# EAGLE schematic HoloCubic (EAGLE 9.6.2)
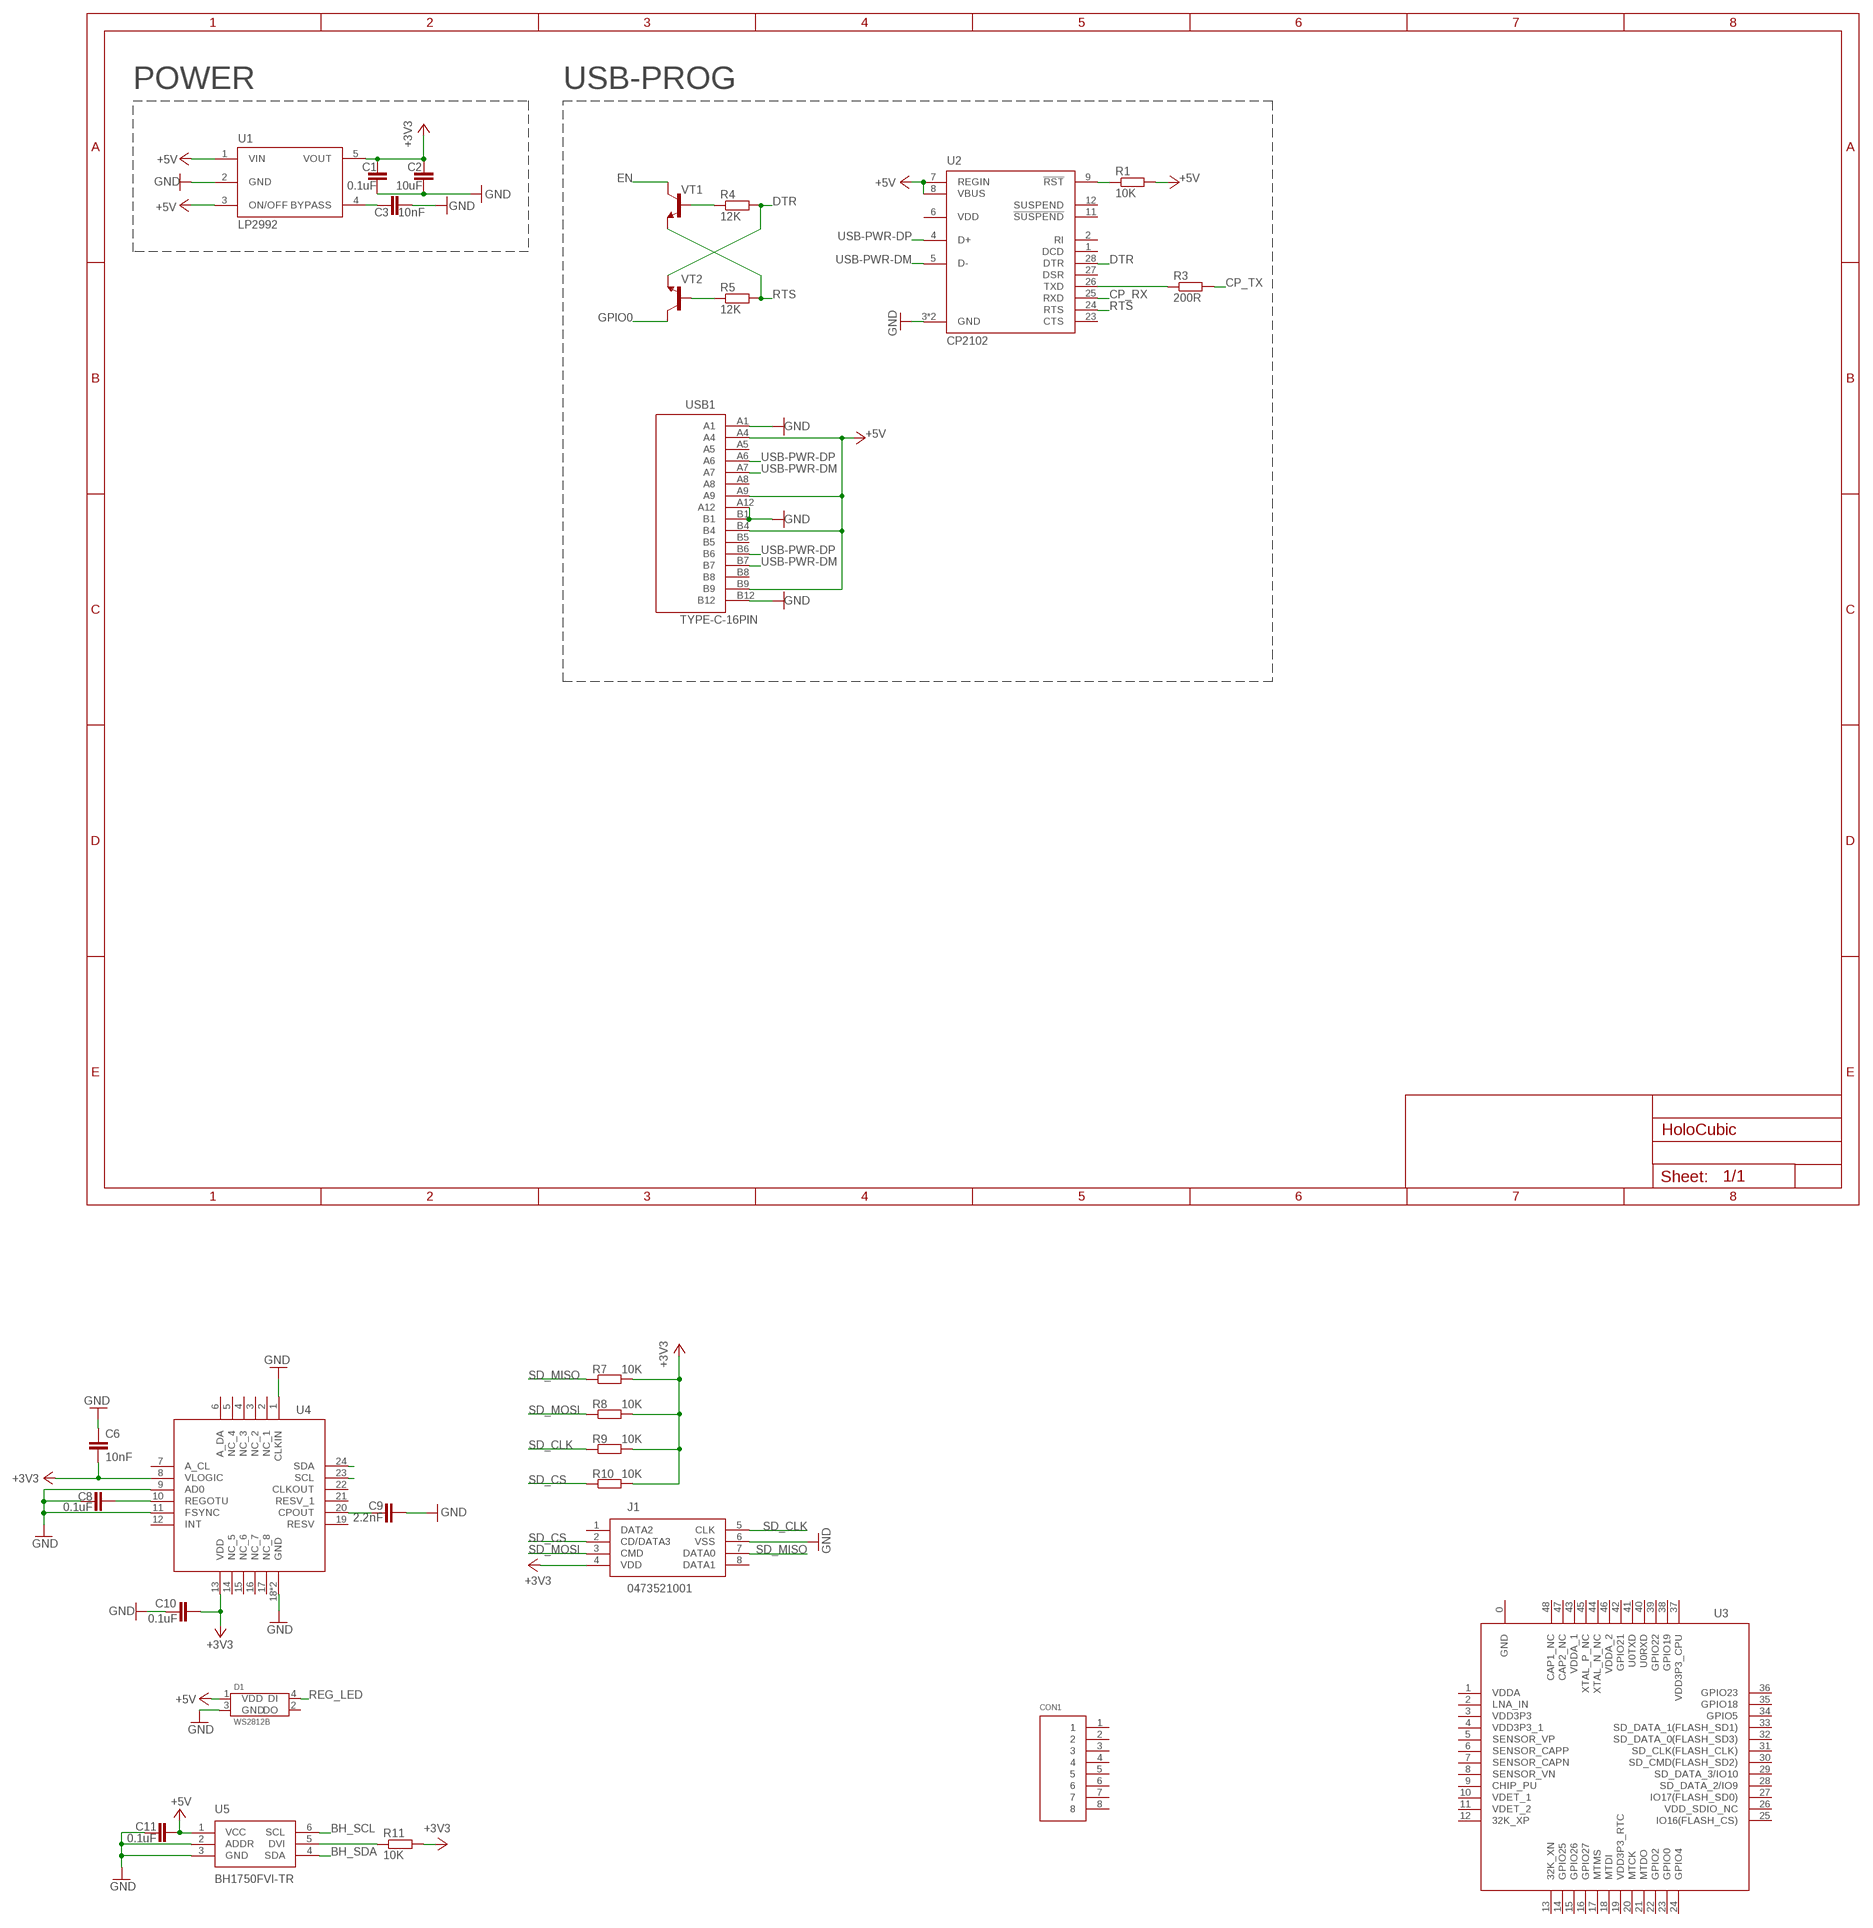
[diagram p0: schematic, sheet 1]

## Parts
C1  0.1uF  C-EUC0402  [C0402]
C2  10uF  C-EUC0402  [C0402]
C3  10nF  C-EUC0402  [C0402]
C6  10nF  C-EUC0402  [C0402]
C8  0.1uF  C-EUC0402  [C0402]
C9  2.2nF  C-EUC0402  [C0402]
C10  0.1uF  C-EUC0402  [C0402]
C11  0.1uF  C-EUC0402  [C0402]
CON1  FPC-0.5MM-8P  [FPC-0.5MM-8P]
D1  WS2812B  [WS2812B]
J1  0473521001  [47352-1001]
R1  10K  R-EU_R0402  [R0402]
R3  200R  R-EU_R0402  [R0402]
R4  12K  R-EU_R0402  [R0402]
R5  12K  R-EU_R0402  [R0402]
R7  10K  R-EU_R0402  [R0402]
R8  10K  R-EU_R0402  [R0402]
R9  10K  R-EU_R0402  [R0402]
R10  10K  R-EU_R0402  [R0402]
R11  10K  R-EU_R0402  [R0402]
U1  LP2992  [SOT95P282X145-5N]
U2  CP2102  [QFN50P500X500X100-29T315N]
U3  ESP32-PICO  [QFN50P700X700X100-49T540N]
U4  MPU6050  [QFN50P400X400X100-25T260N]
U5  BH1750FVI-TR  [WSOF6]
USB1  TYPE-C-16PIN  [TYPE-C-16PIN]
VT1  BC808-NPN-SOT23-BEC  [SOT23-BEC]
VT2  BC808-NPN-SOT23-BEC  [SOT23-BEC]

## Nets
+3V3: C1.1 C2.1 C6.2 C10.2 J1.4(VDD) R7.2 R8.2 R9.2 R10.2 R11.2 U1.5(VOUT) U4.8(VLOGIC) U4.13(VDD)
+5V: C11.2 D1.1(VDD) R1.2 U1.1(VIN) U1.3(ON/OFF) U2.7(REGIN) U2.8(VBUS) U5.1(VCC) USB1.A4 USB1.A9 USB1.B4 USB1.B9
BH_SCL: U5.6(SCL)
BH_SDA: U5.4(SDA)
CP_RX: U2.25(RXD)
CP_TX: R3.2
DTR: R4.2 U2.28(DTR) VT2.E
EN: VT1.C
GND: C1.2 C2.2 C3.2 C6.1 C8.1 C9.2 C10.1 C11.1 D1.3(GND) J1.6(VSS) U1.2(GND) U2.3(GND) U2.29(GND) U4.1(CLKIN) U4.9(AD0) U4.11(FSYNC) U4.18(GND) U4.25(GND) U5.2(ADDR) U5.3(GND) USB1.A1 USB1.A12 USB1.B1 USB1.B12
GPIO0: VT2.C
N$1: C3.1 U1.4(BYPASS)
N$2: R1.1 U2.9(!RST)
N$3: R4.1 VT1.B
N$4: R5.1 VT2.B
N$5: R3.1 U2.26(TXD)
N$6: U4.24(SDA)
N$7: U4.23(SCL)
N$8: C9.1 U4.20(CPOUT)
N$9: C8.2 U4.10(REGOTU)
N$10: R11.1 U5.5(DVI)
REG_LED: D1.4(DI)
RTS: R5.2 U2.24(RTS) VT1.E
SD_CLK: J1.5(CLK) R9.1
SD_CS: J1.2(CD/DATA3) R10.1
SD_MISO: J1.7(DATA0) R7.1
SD_MOSI: J1.3(CMD) R8.1
USB-PWR-DM: U2.5(D-) USB1.A7 USB1.B7
USB-PWR-DP: U2.4(D+) USB1.A6 USB1.B6
Unconnected: CON1.1 CON1.2 CON1.3 CON1.4 CON1.5 CON1.6 CON1.7 CON1.8 D1.2(DO) J1.1(DATA2) J1.8(DATA1) U2.1(DCD) U2.2(RI) U2.11(!SUSPEND) U2.12(SUSPEND) U2.23(CTS) U2.27(DSR) U3.0(GND) U3.1(VDDA) U3.2(LNA_IN) U3.3(VDD3P3) U3.4(VDD3P3_1) U3.5(SENSOR_VP) U3.6(SENSOR_CAPP) U3.7(SENSOR_CAPN) U3.8(SENSOR_VN) U3.9(CHIP_PU) U3.10(VDET_1) U3.11(VDET_2) U3.12(32K_XP) U3.13(32K_XN) U3.14(GPIO25) U3.15(GPIO26) U3.16(GPIO27) U3.17(MTMS) U3.18(MTDI) U3.19(VDD3P3_RTC) U3.20(MTCK) U3.21(MTDO) U3.22(GPIO2) U3.23(GPIO0) U3.24(GPIO4) U3.25(IO16(FLASH_CS)) U3.26(VDD_SDIO_NC) U3.27(IO17(FLASH_SD0)) U3.28(SD_DATA_2/IO9) U3.29(SD_DATA_3/IO10) U3.30(SD_CMD(FLASH_SD2)) U3.31(SD_CLK(FLASH_CLK)) U3.32(SD_DATA_0(FLASH_SD3)) U3.33(SD_DATA_1(FLASH_SD1)) U3.34(GPIO5) U3.35(GPIO18) U3.36(GPIO23) U3.37(VDD3P3_CPU) U3.38(GPIO19) U3.39(GPIO22) U3.40(U0RXD) U3.41(U0TXD) U3.42(GPIO21) U3.43(VDDA_1) U3.44(XTAL_N_NC) U3.45(XTAL_P_NC) U3.46(VDDA_2) U3.47(CAP2_NC) U3.48(CAP1_NC) U4.2(NC_1) U4.3(NC_2) U4.4(NC_3) U4.5(NC_4) U4.6(A_DA) U4.7(A_CL) U4.12(INT) U4.14(NC_5) U4.15(NC_6) U4.16(NC_7) U4.17(NC_8) U4.19(RESV) U4.21(RESV_1) U4.22(CLKOUT) USB1.A5 USB1.A8 USB1.B5 USB1.B8

## Notes on the sheet
- POWER | USB-PROG

## Power pins joined to a net without a drawn wire
VDD: U2.6(VDD)

## Library data of the parts
C1-C3 C6 C8-C11 = rcl:C-EU: CAPACITOR, European symbol; SPICEPREFIX: C
CON1 = common:FPC-0.5MM-8P
D1 = common:WS2812B
J1 = common:0473521001: CONN MICRO SD CARD PUSH-PUSH R/A Source: Datasheet <https://www.molex.com/pdm_docs/sd/473521001_sd.pdf>; ARROW_PART_NUMBER: 0473521001; ARROW_PRICE-STOCK: https://www.arrow.com/en/products/0473521001/molex; DESCRIPTION: CONN MICRO SD CARD PUSH-PUSH R/A; HEIGHT: mm; MANUFACTURER_NAME: Molex; MANUFACTURER_PART_NUMBER: 0473521001
R1 R3-R5 R7-R11 = rcl:R-EU_: RESISTOR, European symbol; SPICEPREFIX: R
U1 = common:LP2992
U2 = common:CP2102: Single-Chip USB to UART Bridge Source: www.silabs.com .. CP2101.pdf / cp2102.pdf
U3 = common:ESP32-PICO
U4 = common:MPU6050
U5 = common:BH1750FVI-TR: Ambient Light Sensor,16bit,I2C,WSOF6I ROHM BH1750FVI-TR Ambient Light Sensor Unit Surface Mount Source: Datasheet <https://componentsearchengine.com/Datasheets/2/BH1750FVI-TR.pdf>; ARROW_PART_NUMBER: BH1750FVI-TR; ARROW_PRICE-STOCK: https://www.arrow.com/en/products/bh1750fvi-tr/rohm-semiconductor; DESCRIPTION: Ambient Light Sensor,16bit,I2C,WSOF6I ROHM BH1750FVI-TR Ambient Light Sensor Unit Surface Mount; HEIGHT: mm; MANUFACTURER_NAME: ROHM Semiconductor; MANUFACTURER_PART_NUMBER: BH1750FVI-TR; MOUSER_PART_NUMBER: 755-BH1750FVI-TR; MOUSER_PRICE-STOCK: https://www.mouser.co.uk/ProductDetail/ROHM-Semiconductor/BH1750FVI-TR?qs=phc6PQ%252BTPUNy88lRCs6mVA%3D%3D
USB1 = usb:TYPE-C-16PIN
VT1 VT2 = transistor:*-NPN-: NPN Transistror BF959 corrected 2008.03.06